# EAGLE design ACESDolginUniversal (EAGLE 9.4.2)
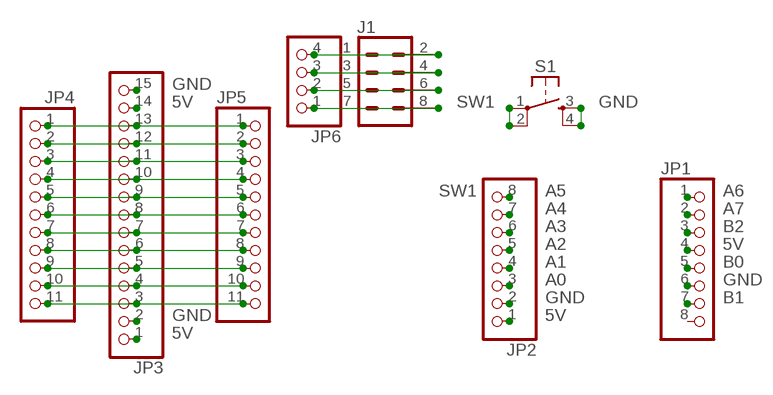
[diagram p0: schematic, sheet 1]

## Parts
J1  CONN_04X2  [2X4]
JP1  PINHD-1X8  [1X08]
JP2  PINHD-1X8  [1X08]
JP3  PINHD-1X15  [1X15]
JP4  PINHD-1X11  [1X11]
JP5  PINHD-1X11  [1X11]
JP6  PINHD-1X4  [1X04]
S1  MOMENTARY_BUTTONS6MMSMALL  [TACTILE_SWITCH_PTH_6.0MM]

## Nets
5V: JP1.4 JP2.1 JP3.1 JP3.14
A0: JP2.3
A1: JP2.4
A2: JP2.5
A3: JP2.6
A4: JP2.7
A5: JP2.8
A6: JP1.1
A7: JP1.2
B0: JP1.5
B1: JP1.7
B2: JP1.3
GND: JP1.6 JP2.2 JP3.2 JP3.15 S1.3(S) S1.4(S1)
N$1: J1.1 J1.2 JP6.4
N$3: J1.3 J1.4 JP6.3
N$5: J1.5 J1.6 JP6.2
N$9: JP3.13 JP4.1 JP5.1
N$13: JP3.12 JP4.2 JP5.2
N$15: JP3.11 JP4.3 JP5.3
N$16: JP3.10 JP4.4 JP5.4
N$18: JP3.9 JP4.5 JP5.5
N$19: JP3.8 JP4.6 JP5.6
N$21: JP3.7 JP4.7 JP5.7
N$22: JP3.6 JP4.8 JP5.8
N$24: JP3.5 JP4.9 JP5.9
N$25: JP3.4 JP4.10 JP5.10
N$27: JP3.3 JP4.11 JP5.11
SW1: J1.7 J1.8 JP6.1 S1.1(P) S1.2(P1)
Unconnected: JP1.8

## Library data of the parts
J1 = SparkFun-Connectors:CONN_04X2: Multi connection point. Often used as Generic Header-pin footprint for 0.1 inch spaced/style header connections On any of the 0.1 inch spaced packages, you can populate with these: Break Away Headers - Straight <https://www.sparkfun.com/products/116> (PRT-00116) Break Away Male Headers - Right Angle <https://www.sparkfun.com/products/553> (PRT-00553) Female Headers <https://www.sparkfun.com/products/115> (PRT-00115) Break Away Headers - Machine Pin <https://www.sparkfun.com/products/117> (PRT-00117) Break Away Female Headers - Swiss Machine Pin <https://www.sparkfun.com/products/743> (PRT-00743)
JP1 JP2 = pinhead:PINHD-1X8: PIN HEADER
JP3 = pinhead:PINHD-1X15: PIN HEADER
JP4 JP5 = pinhead:PINHD-1X11: PIN HEADER
JP6 = pinhead:PINHD-1X4: PIN HEADER
S1 = ACES_THT:MOMENTARY_BUTTONS: OMRON SWITCH

## Board
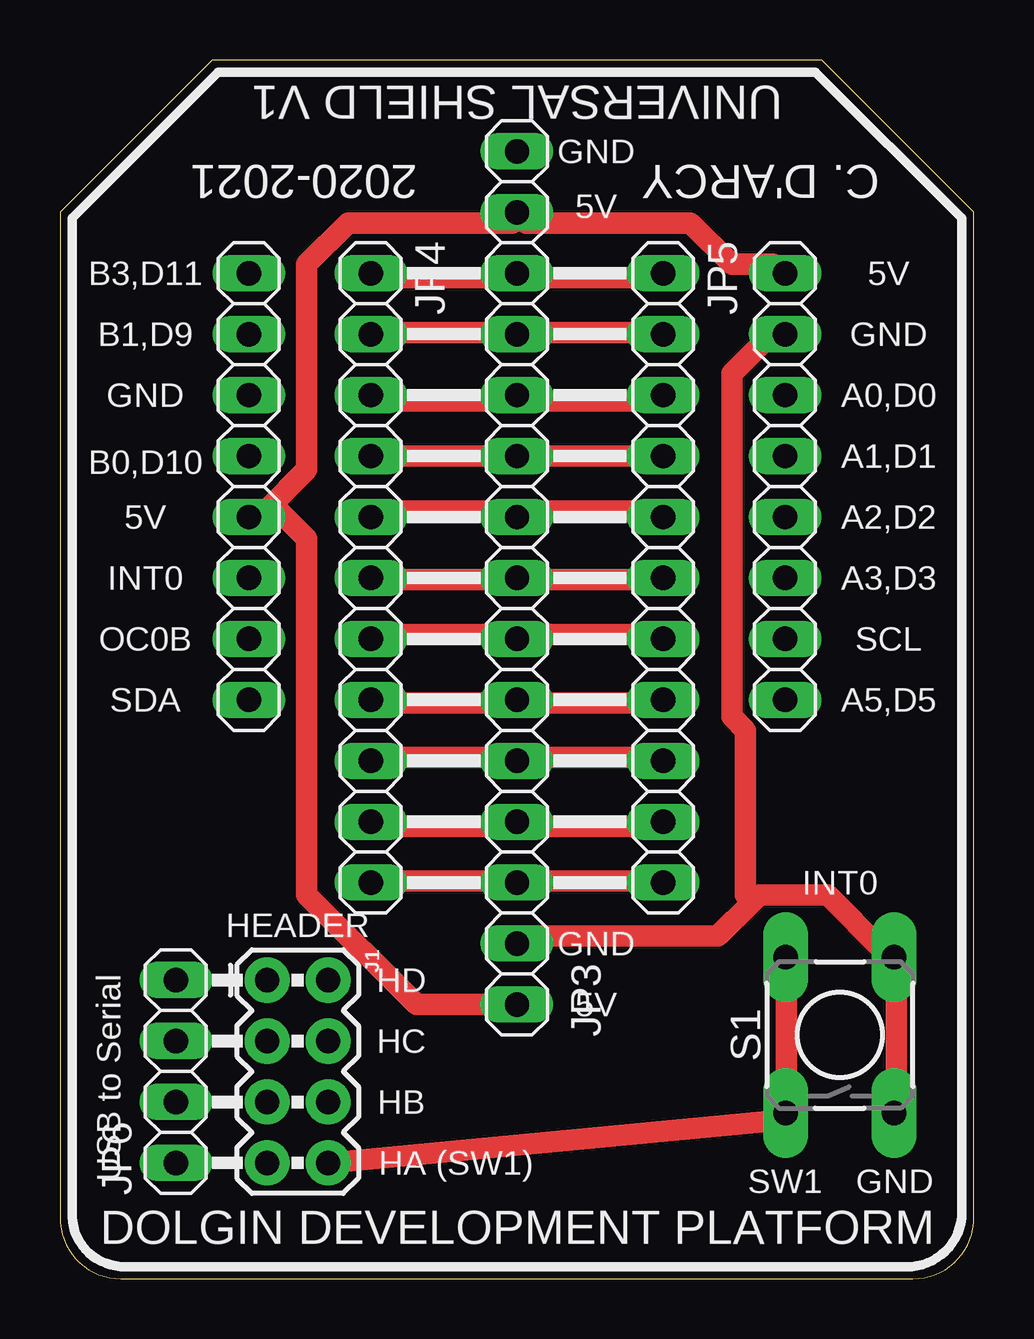
[diagram p1: board, top side]
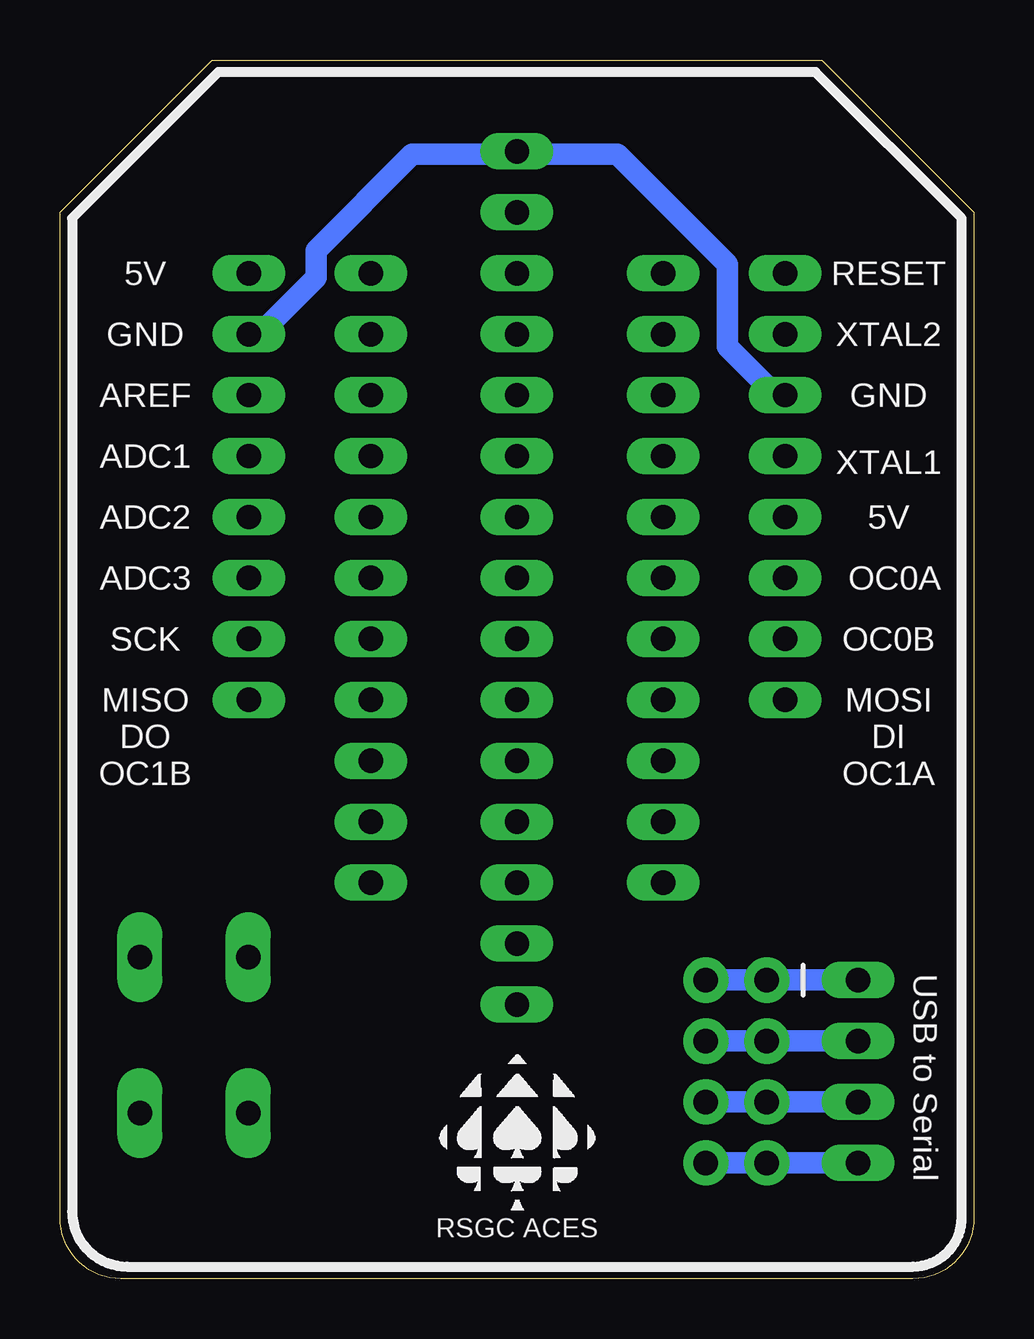
[diagram p2: board, bottom side, seen from below]

Size 38.1 x 50.8 mm. Coordinates in mm from the lower left corner, seen from the top.
Outline: 0,44.45 0,2.54 arc90 2.54,0 35.56,0 arc90 38.1,2.54 38.1,44.45 31.75,50.8 6.35,50.8 0,44.45
Copper layers (1*16): Top 0.035mm / dielectric 1.5mm / Bottom 0.035mm
Design rules "ACES_THT *": minimum track width 35mil, minimum drill 0.35mm, track to track 10mil, track to pad 10mil, pad to pad 10mil, via to via 10mil, smd to smd 6mil, copper to edge 40mil, drill to drill 6mil, minimum pad ring 10mil, minimum via ring 8mil, stop-mask expansion 4mil, vias tented up to drill 0mil, thermal gap 10mil

### Footprints (pad centres in the part's own frame; a part is rotated, then mirrored left to right if it is on the bottom)
2X4 = drill 1.016 pad 1.88: 1 -3.81,-1.27; 2 -3.81,1.27; 3 -1.27,-1.27; 4 -1.27,1.27; 5 1.27,-1.27; 6 1.27,1.27; 7 3.81,-1.27; 8 3.81,1.27
1X08 = drill 1.016 long: 1 -8.89,0; 2 -6.35,0; 3 -3.81,0; 4 -1.27,0; 5 1.27,0; 6 3.81,0; 7 6.35,0; 8 8.89,0
1X15 = drill 1.016 long: 1 -17.78,0; 2 -15.24,0; 3 -12.7,0; 4 -10.16,0; 5 -7.62,0; 6 -5.08,0; 7 -2.54,0; 8 0,0; 9 2.54,0; 10 5.08,0; 11 7.62,0; 12 10.16,0; 13 12.7,0; 14 15.24,0; 15 17.78,0
1X11 = drill 1.016 long: 1 -12.7,0; 2 -10.16,0; 3 -7.62,0; 4 -5.08,0; 5 -2.54,0; 6 0,0; 7 2.54,0; 8 5.08,0; 9 7.62,0; 10 10.16,0; 11 12.7,0
1X04 = drill 1.016 long: 1 -3.81,0; 2 -1.27,0; 3 1.27,0; 4 3.81,0
TACTILE_SWITCH_PTH_6.0MM = drill 1.016 pad 1.88 long: 1 -3.251,2.261; 2 3.251,2.261; 3 -3.251,-2.261; 4 3.251,-2.261

### Placement (x,y rotation side)
J1  9.91,8.64 270 top
JP1  7.87,33.02 90 top
JP2  30.23,33.02 270 top
JP3  19.05,29.21 90 top
JP4  12.95,29.21 270 top
JP5  25.15,29.21 270 top
JP6  4.83,8.64 90 top
S1  32.51,10.16 90 top
U$1  [CAUTION_ELECTRIC]  24.89,12.7 0 top
U$2  [SMALL_TSILK_TEXT]  32.51,20.32 0 top
U$3  [SMALL_TSILK_TEXT]  6.86,20.32 0 top
U$5  [MEDIUM_BSILK_TEXT]  19.05,5.84 0 top

### Tracks (layer width: path | path; a pad name or v marks a point on that pad's centre or on a via)
5V
  Top 0.889: JP3.1 14.86,11.43 10.29,16 10.29,30.86 9.14,32 JP1.4 8,32 8.57,32 10.29,33.72 10.29,42.29 12,44.01 18.86,44.01 JP3.14 19.43,44.01 26.29,44.01 28,42.29 29.72,42.29 JP2.1
GND
  Top 0.889: 28.86,15.72 29.15,16 32,16 34.29,13.72 S1.4 34.86,13.14 34.86,7.43 S1.3 | 28.86,15.72 27.43,14.29 19.43,14.29 JP3.2 | 28.86,15.72 28.57,16 28.57,22.86 28,23.43 28,37.72 29.72,39.43 JP2.2
  Bottom 0.889: JP1.6 8,37.15 8.57,37.15 10.29,38.86 10.29,42.29 14.86,46.86 18.86,46.86 JP3.15 19.43,46.86 23.43,46.86 27.43,42.86 27.43,41.72 29.72,39.43 JP2.2
N$1
  Bottom 0.889: JP6.4 J1.1 J1.2
N$3
  Bottom 0.889: JP6.3 J1.3 J1.4
N$5
  Bottom 0.889: JP6.2 J1.5 J1.6
N$9
  Top 0.889: JP4.1 13.14,41.72 18.86,41.72 JP3.13 19.43,41.72 25.15,41.72 JP5.1
N$13
  Top 0.889: JP4.2 13.14,39.43 18.86,39.43 JP3.12 19.43,39.43 25.15,39.43 JP5.2
N$15
  Top 0.889: JP4.3 13.14,36.58 18.86,36.58 JP3.11 19.43,36.58 25.15,36.58 JP5.3
N$16
  Top 0.889: JP4.4 JP3.10 JP5.4
N$18
  Top 0.889: JP4.5 13.14,32 18.86,32 JP3.9 19.43,32 25.15,32 JP5.5
N$19
  Top 0.889: JP4.6 13.14,29.15 18.86,29.15 JP3.8 19.43,29.15 25.15,29.15 JP5.6
N$21
  Top 0.889: JP4.7 13.14,26.86 18.86,26.86 JP3.7 19.43,26.86 25.15,26.86 JP5.7
N$22
  Top 0.889: JP4.8 13.14,24 18.86,24 JP3.6 19.43,24 25.15,24 JP5.8
N$24
  Top 0.889: JP4.9 13.14,21.72 18.86,21.72 JP3.5 19.43,21.72 25.15,21.72 JP5.9
N$25
  Top 0.889: JP4.10 13.14,18.86 18.86,18.86 JP3.4 19.43,18.86 25.15,18.86 JP5.10
N$27
  Top 0.889: JP4.11 13.14,16.57 18.86,16.57 JP3.3 19.43,16.57 25.15,16.57 JP5.11
SW1
  Top 0.889: S1.2 30.29,13.14 30.29,7.43 S1.1 29.94,6.6 11.27,4.82 11.18,4.86 J1.8
  Bottom 0.889: JP6.1 J1.7 J1.8

### Text on the board
_tsilk: UNIVERSAL SHIELD V1 | GND | 2020-2021 | C. D'ARCY | 5V | B3,D11 | 5V | B1,D9 | GND | GND | A0,D0 | B0,D10 | A1,D1 | 5V | A2,D2 | INT0 | A3,D3 | OC0B | SCL | SDA | A5,D5 | INT0 | HEADER | GND | HD | 5V | HC | USB to Serial | HB | HA (SW1) | SW1 | GND | DOLGIN DEVELOPMENT PLATFORM
_bsilk: RESET | 5V | XTAL2 | GND | GND | AREF | XTAL1 | ADC1 | 5V | ADC2 | OC0A | ADC3 | OC0B | SCK | MOSI / DI / OC1A | MISO / DO / OC1B | USB to Serial